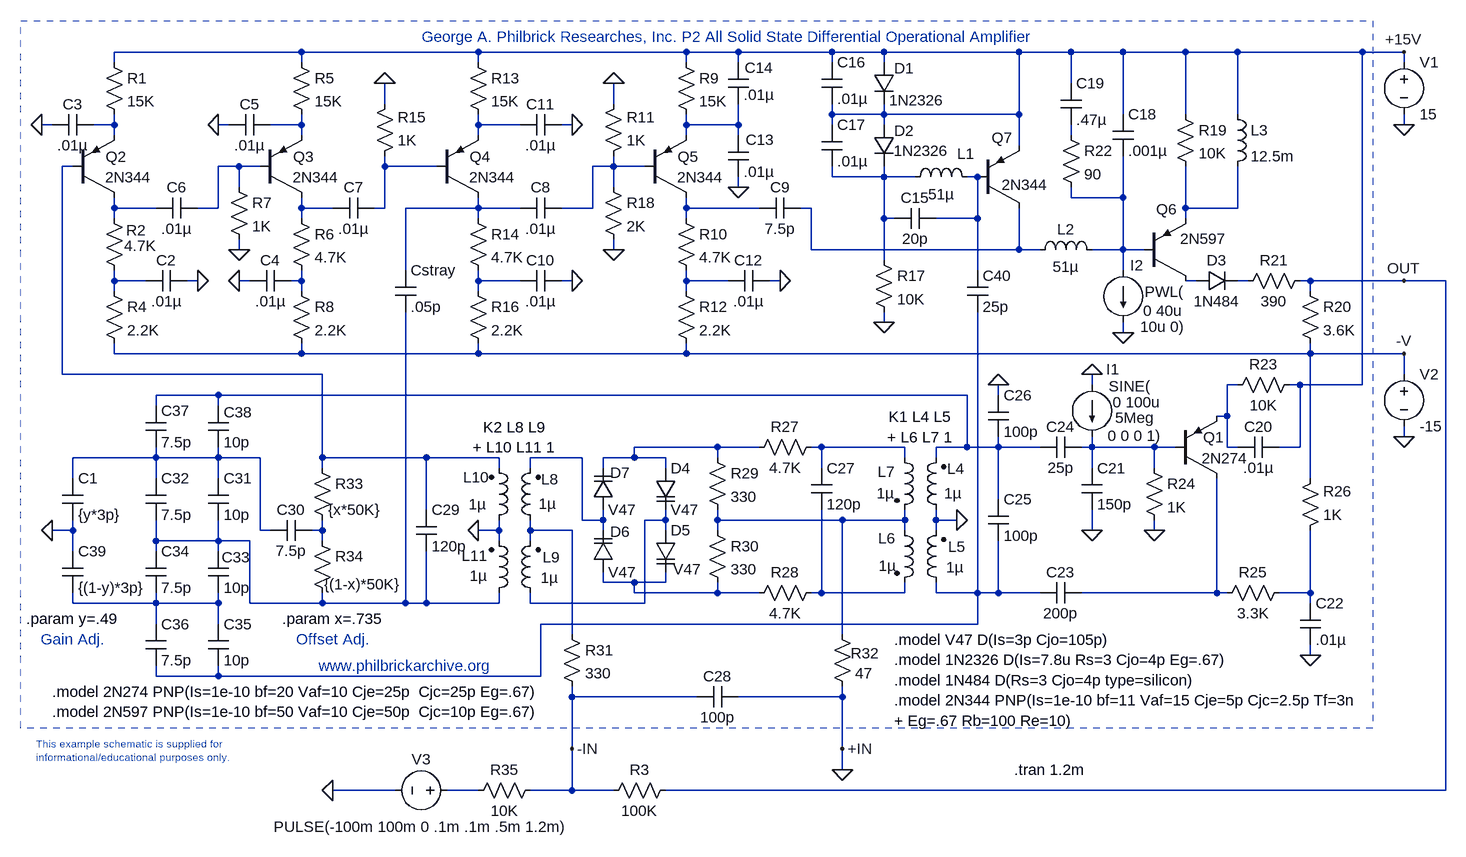
[diagram p0: schematic P2.asc]
P2.asc, the LTspice schematic file:
Version 4
SHEET 1 2948 1524
WIRE 464 16 176 16
WIRE 736 16 464 16
WIRE 1056 16 736 16
WIRE 1136 16 1056 16
WIRE 1280 16 1136 16
WIRE 1360 16 1280 16
WIRE 1568 16 1360 16
WIRE 1648 16 1568 16
WIRE 1728 16 1648 16
WIRE 1824 16 1728 16
WIRE 1904 16 1824 16
WIRE 2096 16 1904 16
WIRE 2160 16 2096 16
WIRE 176 32 176 16
WIRE 464 32 464 16
WIRE 736 32 736 16
WIRE 1056 32 1056 16
WIRE 1136 32 1136 16
WIRE 1280 32 1280 16
WIRE 1360 32 1360 16
WIRE 2160 32 2160 16
WIRE 1648 64 1648 16
WIRE 592 96 592 64
WIRE 944 96 944 64
WIRE 1280 112 1280 96
WIRE 1360 112 1360 96
WIRE 1360 112 1280 112
WIRE 1568 112 1568 16
WIRE 1568 112 1360 112
WIRE 1728 112 1728 16
WIRE 1824 112 1824 16
WIRE 1904 112 1904 16
WIRE 80 128 64 128
WIRE 176 128 176 112
WIRE 176 128 144 128
WIRE 352 128 336 128
WIRE 464 128 464 112
WIRE 464 128 416 128
WIRE 736 128 736 112
WIRE 800 128 736 128
WIRE 880 128 864 128
WIRE 1056 128 1056 112
WIRE 1136 128 1136 96
WIRE 1136 128 1056 128
WIRE 1280 128 1280 112
WIRE 1360 128 1360 112
WIRE 2160 128 2160 112
WIRE 176 144 176 128
WIRE 464 144 464 128
WIRE 736 144 736 128
WIRE 1056 144 1056 128
WIRE 1136 144 1136 128
WIRE 1648 144 1648 128
WIRE 1568 160 1568 112
WIRE 112 192 96 192
WIRE 368 192 336 192
WIRE 400 192 368 192
WIRE 592 192 592 176
WIRE 672 192 592 192
WIRE 944 192 944 176
WIRE 944 192 912 192
WIRE 992 192 944 192
WIRE 1280 208 1280 192
WIRE 1360 208 1360 192
WIRE 1360 208 1280 208
WIRE 1408 208 1360 208
WIRE 1504 208 1488 208
WIRE 368 224 368 192
WIRE 944 224 944 192
WIRE 1136 224 1136 208
WIRE 1648 240 1648 224
WIRE 1728 240 1728 176
WIRE 1728 240 1648 240
WIRE 176 256 176 240
WIRE 240 256 176 256
WIRE 336 256 336 192
WIRE 336 256 304 256
WIRE 464 256 464 240
WIRE 512 256 464 256
WIRE 592 256 592 192
WIRE 592 256 576 256
WIRE 736 256 736 240
WIRE 736 256 624 256
WIRE 800 256 736 256
WIRE 912 256 912 192
WIRE 912 256 864 256
WIRE 1056 256 1056 240
WIRE 1168 256 1056 256
WIRE 1248 256 1232 256
WIRE 1824 256 1824 192
WIRE 1904 256 1904 192
WIRE 1904 256 1824 256
WIRE 176 272 176 256
WIRE 464 272 464 256
WIRE 736 272 736 256
WIRE 1056 272 1056 256
WIRE 1360 272 1360 208
WIRE 1376 272 1360 272
WIRE 1504 272 1504 208
WIRE 1504 272 1440 272
WIRE 1824 272 1824 256
WIRE 368 320 368 304
WIRE 944 320 944 304
WIRE 1248 320 1248 256
WIRE 1568 320 1568 256
WIRE 1568 320 1248 320
WIRE 1600 320 1568 320
WIRE 1728 320 1728 240
WIRE 1728 320 1680 320
WIRE 1760 320 1728 320
WIRE 1360 336 1360 272
WIRE 624 352 624 256
WIRE 1504 352 1504 272
WIRE 1728 352 1728 320
WIRE 176 368 176 352
WIRE 224 368 176 368
WIRE 304 368 288 368
WIRE 384 368 368 368
WIRE 464 368 464 352
WIRE 464 368 448 368
WIRE 736 368 736 352
WIRE 800 368 736 368
WIRE 880 368 864 368
WIRE 1056 368 1056 352
WIRE 1120 368 1056 368
WIRE 1200 368 1184 368
WIRE 1840 368 1824 368
WIRE 1920 368 1904 368
WIRE 2016 368 2000 368
WIRE 2160 368 2016 368
WIRE 2224 368 2160 368
WIRE 176 384 176 368
WIRE 464 384 464 368
WIRE 736 384 736 368
WIRE 1056 384 1056 368
WIRE 2016 384 2016 368
WIRE 1360 432 1360 416
WIRE 1728 448 1728 432
WIRE 176 480 176 464
WIRE 464 480 464 464
WIRE 464 480 176 480
WIRE 736 480 736 464
WIRE 736 480 464 480
WIRE 1056 480 1056 464
WIRE 1056 480 736 480
WIRE 2016 480 2016 464
WIRE 2016 480 1056 480
WIRE 2160 480 2016 480
WIRE 96 512 96 192
WIRE 496 512 96 512
WIRE 2160 512 2160 480
WIRE 1680 528 1680 512
WIRE 1904 528 1888 528
WIRE 2000 528 1984 528
WIRE 2096 528 2096 16
WIRE 2096 528 2000 528
WIRE 336 544 240 544
WIRE 1488 544 336 544
WIRE 1536 544 1536 528
WIRE 240 560 240 544
WIRE 336 560 336 544
WIRE 1888 576 1888 528
WIRE 1888 576 1872 576
WIRE 2160 608 2160 592
WIRE 1104 624 976 624
WIRE 1168 624 1104 624
WIRE 1264 624 1248 624
WIRE 1392 624 1264 624
WIRE 1488 624 1488 544
WIRE 1488 624 1440 624
WIRE 1536 624 1536 608
WIRE 1536 624 1488 624
WIRE 1600 624 1536 624
WIRE 1680 624 1680 608
WIRE 1680 624 1664 624
WIRE 1776 624 1680 624
WIRE 1808 624 1776 624
WIRE 1888 624 1888 576
WIRE 1904 624 1888 624
WIRE 2000 624 2000 528
WIRE 2000 624 1968 624
WIRE 240 640 240 624
WIRE 240 640 112 640
WIRE 336 640 336 624
WIRE 336 640 240 640
WIRE 400 640 336 640
WIRE 496 640 496 512
WIRE 656 640 496 640
WIRE 768 640 656 640
WIRE 896 640 816 640
WIRE 976 640 976 624
WIRE 976 640 928 640
WIRE 1024 640 976 640
WIRE 1104 640 1104 624
WIRE 1392 640 1392 624
WIRE 1440 640 1440 624
WIRE 496 656 496 640
WIRE 768 656 768 640
WIRE 816 656 816 640
WIRE 928 656 928 640
WIRE 1024 656 1024 640
WIRE 1264 656 1264 624
WIRE 1680 656 1680 624
WIRE 1776 656 1776 624
WIRE 112 672 112 640
WIRE 240 672 240 640
WIRE 336 672 336 640
WIRE 2016 672 2016 480
WIRE 1536 704 1536 624
WIRE 656 720 656 640
WIRE 896 736 896 640
WIRE 928 736 928 720
WIRE 928 736 896 736
WIRE 1024 736 1024 720
WIRE 1024 736 992 736
WIRE 1104 736 1104 720
WIRE 1296 736 1104 736
WIRE 1392 736 1392 720
WIRE 1392 736 1296 736
WIRE 1440 736 1440 720
WIRE 1472 736 1440 736
WIRE 112 752 112 736
WIRE 112 752 80 752
WIRE 400 752 400 640
WIRE 416 752 400 752
WIRE 496 752 496 736
WIRE 496 752 480 752
WIRE 768 752 768 736
WIRE 768 752 736 752
WIRE 816 752 816 736
WIRE 880 752 816 752
WIRE 928 752 928 736
WIRE 1024 752 1024 736
WIRE 1104 752 1104 736
WIRE 1392 752 1392 736
WIRE 1440 752 1440 736
WIRE 1680 752 1680 720
WIRE 1776 752 1776 736
WIRE 240 768 240 736
WIRE 336 768 336 736
WIRE 336 768 240 768
WIRE 384 768 336 768
WIRE 496 768 496 752
WIRE 768 768 768 752
WIRE 816 768 816 752
WIRE 112 784 112 752
WIRE 240 784 240 768
WIRE 336 784 336 768
WIRE 928 832 928 816
WIRE 976 832 928 832
WIRE 1024 832 1024 816
WIRE 1024 832 976 832
WIRE 976 848 976 832
WIRE 1104 848 1104 832
WIRE 1104 848 976 848
WIRE 1168 848 1104 848
WIRE 1264 848 1264 720
WIRE 1264 848 1248 848
WIRE 1392 848 1392 832
WIRE 1392 848 1264 848
WIRE 1440 848 1440 832
WIRE 1504 848 1504 416
WIRE 1504 848 1440 848
WIRE 1536 848 1536 768
WIRE 1536 848 1504 848
WIRE 1600 848 1536 848
WIRE 1872 848 1872 672
WIRE 1872 848 1664 848
WIRE 1888 848 1872 848
WIRE 2016 848 2016 752
WIRE 2016 848 1968 848
WIRE 112 864 112 848
WIRE 240 864 240 848
WIRE 240 864 112 864
WIRE 336 864 336 848
WIRE 336 864 240 864
WIRE 384 864 384 768
WIRE 496 864 496 848
WIRE 496 864 384 864
WIRE 624 864 624 416
WIRE 624 864 496 864
WIRE 656 864 656 784
WIRE 656 864 624 864
WIRE 768 864 768 848
WIRE 768 864 656 864
WIRE 816 864 816 848
WIRE 992 864 992 736
WIRE 992 864 816 864
WIRE 2016 864 2016 848
WIRE 240 896 240 864
WIRE 336 896 336 864
WIRE 1504 896 1504 848
WIRE 1504 896 832 896
WIRE 880 912 880 752
WIRE 1296 912 1296 736
WIRE 2016 944 2016 928
WIRE 240 976 240 960
WIRE 336 976 336 960
WIRE 336 976 240 976
WIRE 832 976 832 896
WIRE 832 976 336 976
WIRE 880 1008 880 992
WIRE 1072 1008 880 1008
WIRE 1296 1008 1296 992
WIRE 1296 1008 1136 1008
WIRE 880 1088 880 1008
WIRE 1296 1088 1296 1008
WIRE 1296 1120 1296 1088
WIRE 608 1152 512 1152
WIRE 736 1152 688 1152
WIRE 880 1152 880 1088
WIRE 880 1152 816 1152
WIRE 944 1152 880 1152
WIRE 2224 1152 2224 368
WIRE 2224 1152 1024 1152
FLAG 2160 16 +15V
FLAG 2160 128 0
FLAG 2160 608 0
FLAG 304 368 0
FLAG 64 128 0
FLAG 368 320 0
FLAG 368 368 0
FLAG 336 128 0
FLAG 592 64 0
FLAG 880 368 0
FLAG 880 128 0
FLAG 944 64 0
FLAG 1200 368 0
FLAG 1136 224 0
FLAG 944 320 0
FLAG 1360 432 0
FLAG 1776 752 0
FLAG 2016 944 0
FLAG 1680 752 0
FLAG 1536 528 0
FLAG 1472 736 0
FLAG 1296 1120 0
FLAG 736 752 0
FLAG 80 752 0
FLAG 1680 512 0
FLAG 1728 448 0
FLAG 2160 480 -V
FLAG 2160 368 OUT
FLAG 880 1088 -IN
FLAG 1296 1088 +IN
FLAG 512 1152 0
SYMBOL pnp 112 240 M180
WINDOW 0 51 63 Left 2
WINDOW 3 50 31 Left 2
SYMATTR InstName Q2
SYMATTR Value 2N344
SYMBOL res 160 16 R0
SYMATTR InstName R1
SYMATTR Value 15K
SYMBOL res 160 256 R0
WINDOW 0 34 34 Left 2
WINDOW 3 31 58 Left 2
SYMATTR InstName R2
SYMATTR Value 4.7K
SYMBOL res 160 368 R0
SYMATTR InstName R4
SYMATTR Value 2.2K
SYMBOL voltage 2160 16 R0
SYMATTR InstName V1
SYMATTR Value 15
SYMBOL voltage 2160 496 R0
SYMATTR InstName V2
SYMATTR Value -15
SYMBOL cap 288 384 M270
WINDOW 0 32 32 VTop 2
WINDOW 3 0 32 VBottom 2
SYMATTR InstName C2
SYMATTR Value .01µ
SYMBOL cap 80 144 R270
WINDOW 0 32 32 VTop 2
WINDOW 3 0 32 VBottom 2
SYMATTR InstName C3
SYMATTR Value .01µ
SYMBOL res 448 16 R0
SYMATTR InstName R5
SYMATTR Value 15K
SYMBOL res 448 256 R0
SYMATTR InstName R6
SYMATTR Value 4.7K
SYMBOL res 352 208 R0
SYMATTR InstName R7
SYMATTR Value 1K
SYMBOL res 448 368 R0
SYMATTR InstName R8
SYMATTR Value 2.2K
SYMBOL cap 384 384 R270
WINDOW 0 32 32 VTop 2
WINDOW 3 0 32 VBottom 2
SYMATTR InstName C4
SYMATTR Value .01µ
SYMBOL cap 352 144 R270
WINDOW 0 32 32 VTop 2
WINDOW 3 0 32 VBottom 2
SYMATTR InstName C5
SYMATTR Value .01µ
SYMBOL res 720 16 R0
SYMATTR InstName R13
SYMATTR Value 15K
SYMBOL res 720 256 R0
SYMATTR InstName R14
SYMATTR Value 4.7K
SYMBOL res 576 192 M180
WINDOW 0 36 76 Left 2
WINDOW 3 36 40 Left 2
SYMATTR InstName R15
SYMATTR Value 1K
SYMBOL res 720 368 R0
SYMATTR InstName R16
SYMATTR Value 2.2K
SYMBOL cap 864 384 M270
WINDOW 0 32 32 VTop 2
WINDOW 3 0 32 VBottom 2
SYMATTR InstName C10
SYMATTR Value .01µ
SYMBOL cap 864 112 R90
WINDOW 0 0 32 VBottom 2
WINDOW 3 32 32 VTop 2
SYMATTR InstName C11
SYMATTR Value .01µ
SYMBOL res 1040 16 R0
SYMATTR InstName R9
SYMATTR Value 15K
SYMBOL res 1040 256 R0
SYMATTR InstName R10
SYMATTR Value 4.7K
SYMBOL res 928 192 M180
WINDOW 0 36 76 Left 2
WINDOW 3 36 40 Left 2
SYMATTR InstName R11
SYMATTR Value 1K
SYMBOL res 1040 368 R0
SYMATTR InstName R12
SYMATTR Value 2.2K
SYMBOL cap 1184 384 M270
WINDOW 0 32 32 VTop 2
WINDOW 3 0 32 VBottom 2
SYMATTR InstName C12
SYMATTR Value .01µ
SYMBOL cap 1120 208 M180
WINDOW 0 27 57 Left 2
WINDOW 3 24 8 Left 2
SYMATTR InstName C13
SYMATTR Value .01µ
SYMBOL cap 304 272 M270
WINDOW 0 32 32 VTop 2
WINDOW 3 0 32 VBottom 2
SYMATTR InstName C6
SYMATTR Value .01µ
SYMBOL cap 576 272 M270
WINDOW 0 32 32 VTop 2
WINDOW 3 0 32 VBottom 2
SYMATTR InstName C7
SYMATTR Value .01µ
SYMBOL cap 864 272 M270
WINDOW 0 32 32 VTop 2
WINDOW 3 0 32 VBottom 2
SYMATTR InstName C8
SYMATTR Value .01µ
SYMBOL cap 1232 272 M270
WINDOW 0 32 32 VTop 2
WINDOW 3 0 32 VBottom 2
SYMATTR InstName C9
SYMATTR Value 7.5p
SYMBOL pnp 400 240 M180
WINDOW 0 51 63 Left 2
WINDOW 3 50 31 Left 2
SYMATTR InstName Q3
SYMATTR Value 2N344
SYMBOL pnp 672 240 M180
WINDOW 0 51 63 Left 2
WINDOW 3 50 31 Left 2
SYMATTR InstName Q4
SYMATTR Value 2N344
SYMBOL pnp 992 240 M180
WINDOW 0 51 63 Left 2
WINDOW 3 50 31 Left 2
SYMATTR InstName Q5
SYMATTR Value 2N344
SYMBOL res 928 208 R0
SYMATTR InstName R18
SYMATTR Value 2K
SYMBOL cap 1120 96 M180
WINDOW 0 26 56 Left 2
WINDOW 3 24 14 Left 2
SYMATTR InstName C14
SYMATTR Value .01µ
SYMBOL pnp 1504 256 M180
WINDOW 0 54 108 Right 2
WINDOW 3 37 36 Left 2
SYMATTR InstName Q7
SYMATTR Value 2N344
SYMBOL diode 1344 32 R0
WINDOW 0 32 9 Left 2
WINDOW 3 24 58 Left 2
SYMATTR InstName D1
SYMATTR Value 1N2326
SYMBOL cap 1264 96 M180
WINDOW 0 24 64 Left 2
WINDOW 3 24 8 Left 2
SYMATTR InstName C16
SYMATTR Value .01µ
SYMBOL cap 1264 192 M180
WINDOW 0 24 64 Left 2
WINDOW 3 24 8 Left 2
SYMATTR InstName C17
SYMATTR Value .01µ
SYMBOL ind 1392 224 R270
WINDOW 0 36 94 VTop 2
WINDOW 3 5 56 VBottom 2
SYMATTR InstName L1
SYMATTR Value 51µ
SYMATTR SpiceLine Rser=1
SYMBOL ind 1584 336 R270
WINDOW 0 32 56 VTop 2
WINDOW 3 5 56 VBottom 2
SYMATTR InstName L2
SYMATTR Value 51µ
SYMATTR SpiceLine Rser=1
SYMBOL cap 1440 256 R90
WINDOW 0 0 32 VBottom 2
WINDOW 3 32 32 VTop 2
SYMATTR InstName C15
SYMATTR Value 20p
SYMBOL res 1344 320 R0
SYMATTR InstName R17
SYMATTR Value 10K
SYMBOL diode 1344 128 R0
WINDOW 0 32 9 Left 2
WINDOW 3 31 40 Left 2
SYMATTR InstName D2
SYMATTR Value 1N2326
SYMBOL pnp 1760 368 M180
WINDOW 0 51 110 Right 2
WINDOW 3 56 65 Left 2
SYMATTR InstName Q6
SYMATTR Value 2N597
SYMBOL res 1808 96 R0
SYMATTR InstName R19
SYMATTR Value 10K
SYMBOL ind 1888 96 R0
SYMATTR InstName L3
SYMATTR Value 12.5m
SYMBOL diode 1840 384 R270
WINDOW 3 0 32 VBottom 2
WINDOW 0 32 32 VTop 2
SYMATTR Value 1N484
SYMATTR InstName D3
SYMBOL res 2000 368 R0
SYMATTR InstName R20
SYMATTR Value 3.6K
SYMBOL res 1904 384 R270
WINDOW 0 32 56 VTop 2
WINDOW 3 0 56 VBottom 2
SYMATTR InstName R21
SYMATTR Value 390
SYMBOL cap 1712 176 M180
WINDOW 0 24 64 Left 2
WINDOW 3 24 8 Left 2
SYMATTR InstName C18
SYMATTR Value .001µ
SYMBOL cap 1632 128 M180
WINDOW 0 24 64 Left 2
WINDOW 3 24 8 Left 2
SYMATTR InstName C19
SYMATTR Value .47µ
SYMBOL res 1632 128 R0
SYMATTR InstName R22
SYMATTR Value 90
SYMBOL pnp 1808 672 M180
WINDOW 0 43 63 Left 2
WINDOW 3 41 31 Left 2
SYMATTR InstName Q1
SYMATTR Value 2N274
SYMBOL res 2000 512 R90
WINDOW 0 0 56 VBottom 2
WINDOW 3 32 56 VTop 2
SYMATTR InstName R23
SYMATTR Value 10K
SYMBOL cap 1904 608 M90
WINDOW 0 0 32 VBottom 2
WINDOW 3 32 32 VTop 2
SYMATTR InstName C20
SYMATTR Value .01µ
SYMBOL res 1760 640 R0
SYMATTR InstName R24
SYMATTR Value 1K
SYMBOL cap 1664 720 M180
WINDOW 0 24 64 Left 2
WINDOW 3 24 8 Left 2
SYMATTR InstName C21
SYMATTR Value 150p
SYMBOL res 1872 864 R270
WINDOW 0 32 56 VTop 2
WINDOW 3 0 56 VBottom 2
SYMATTR InstName R25
SYMATTR Value 3.3K
SYMBOL res 2000 768 M180
WINDOW 0 36 76 Left 2
WINDOW 3 36 40 Left 2
SYMATTR InstName R26
SYMATTR Value 1K
SYMBOL cap 2000 928 M180
WINDOW 0 24 64 Left 2
WINDOW 3 24 8 Left 2
SYMATTR InstName C22
SYMATTR Value .01µ
SYMBOL cap 1664 864 M270
WINDOW 0 32 32 VTop 2
WINDOW 3 0 32 VBottom 2
SYMATTR InstName C23
SYMATTR Value 200p
SYMBOL cap 1664 640 M270
WINDOW 0 32 32 VTop 2
WINDOW 3 0 32 VBottom 2
SYMATTR InstName C24
SYMATTR Value 25p
SYMBOL cap 1520 768 M180
WINDOW 0 24 64 Left 2
WINDOW 3 24 8 Left 2
SYMATTR InstName C25
SYMATTR Value 100p
SYMBOL cap 1520 608 M180
WINDOW 0 24 64 Left 2
WINDOW 3 24 8 Left 2
SYMATTR InstName C26
SYMATTR Value 100p
SYMBOL ind2 1456 736 R180
WINDOW 0 -1 79 Right 2
WINDOW 3 3 41 Right 2
SYMATTR InstName L4
SYMATTR Value 1µ
SYMATTR Type ind
SYMBOL ind2 1456 848 R180
WINDOW 0 -3 71 Right 2
WINDOW 3 0 39 Right 2
SYMATTR InstName L5
SYMATTR Value 1µ
SYMATTR Type ind
SYMBOL ind2 1376 736 R0
WINDOW 0 2 28 Right 2
WINDOW 3 3 70 Right 2
SYMATTR InstName L6
SYMATTR Value 1µ
SYMATTR Type ind
SYMBOL ind2 1376 624 R0
WINDOW 0 1 38 Right 2
WINDOW 3 0 71 Right 2
SYMATTR InstName L7
SYMATTR Value 1µ
SYMATTR Type ind
SYMBOL cap 1248 720 M180
WINDOW 0 24 64 Left 2
WINDOW 3 24 8 Left 2
SYMATTR InstName C27
SYMATTR Value 120p
SYMBOL res 1264 608 R90
WINDOW 0 0 56 VBottom 2
WINDOW 3 32 56 VTop 2
SYMATTR InstName R27
SYMATTR Value 4.7K
SYMBOL res 1264 832 R90
WINDOW 0 0 56 VBottom 2
WINDOW 3 32 56 VTop 2
SYMATTR InstName R28
SYMATTR Value 4.7K
SYMBOL res 1088 624 R0
SYMATTR InstName R29
SYMATTR Value 330
SYMBOL res 1088 736 R0
SYMATTR InstName R30
SYMATTR Value 330
SYMBOL varactor 1008 656 R0
SYMATTR Value V47
SYMATTR InstName D4
SYMBOL varactor 1008 752 R0
WINDOW 3 28 60 Left 2
SYMATTR Value V47
SYMATTR InstName D5
SYMBOL varactor 912 816 M180
WINDOW 0 27 62 Left 2
WINDOW 3 24 0 Left 2
SYMATTR InstName D6
SYMATTR Value V47
SYMBOL varactor 912 720 M180
WINDOW 0 27 57 Left 2
WINDOW 3 24 0 Left 2
SYMATTR InstName D7
SYMATTR Value V47
SYMBOL ind2 832 752 R180
WINDOW 0 -1 79 Right 2
WINDOW 3 3 41 Right 2
SYMATTR InstName L8
SYMATTR Value 1µ
SYMATTR Type ind
SYMBOL ind2 832 864 R180
WINDOW 0 -3 71 Right 2
WINDOW 3 0 39 Right 2
SYMATTR InstName L9
SYMATTR Value 1µ
SYMATTR Type ind
SYMBOL ind2 752 752 M180
WINDOW 0 1 82 Right 2
WINDOW 3 -4 40 Right 2
SYMATTR InstName L10
SYMATTR Value 1µ
SYMATTR Type ind
SYMBOL ind2 752 864 M180
WINDOW 0 -1 73 Right 2
WINDOW 3 -2 42 Right 2
SYMATTR InstName L11
SYMATTR Value 1µ
SYMATTR Type ind
SYMBOL res 864 896 R0
SYMATTR InstName R31
SYMATTR Value 330
SYMBOL res 1280 896 R0
WINDOW 0 29 45 Left 2
SYMATTR InstName R32
SYMATTR Value 47
SYMBOL cap 1136 1024 M270
WINDOW 0 32 32 VTop 2
WINDOW 3 0 32 VBottom 2
SYMATTR InstName C28
SYMATTR Value 100p
SYMBOL cap 640 784 M180
WINDOW 0 24 64 Left 2
WINDOW 3 24 8 Left 2
SYMATTR InstName C29
SYMATTR Value 120p
SYMBOL res 480 640 R0
WINDOW 3 25 80 Left 2
SYMATTR Value {x*50K}
SYMATTR InstName R33
SYMBOL res 480 752 R0
WINDOW 3 19 83 Left 2
SYMATTR Value {(1-x)*50K}
SYMATTR InstName R34
SYMBOL cap 480 768 M270
WINDOW 0 32 32 VTop 2
WINDOW 3 0 32 VBottom 2
SYMATTR InstName C30
SYMATTR Value 7.5p
SYMBOL cap 320 736 M180
WINDOW 0 24 64 Left 2
WINDOW 3 24 8 Left 2
SYMATTR InstName C31
SYMATTR Value 10p
SYMBOL cap 224 736 M180
WINDOW 0 24 64 Left 2
WINDOW 3 24 8 Left 2
SYMATTR InstName C32
SYMATTR Value 7.5p
SYMBOL cap 320 848 M180
WINDOW 0 21 55 Left 2
WINDOW 3 24 8 Left 2
SYMATTR InstName C33
SYMATTR Value 10p
SYMBOL cap 224 848 M180
WINDOW 0 24 64 Left 2
WINDOW 3 24 8 Left 2
SYMATTR InstName C34
SYMATTR Value 7.5p
SYMBOL cap 320 960 M180
WINDOW 0 24 64 Left 2
WINDOW 3 24 8 Left 2
SYMATTR InstName C35
SYMATTR Value 10p
SYMBOL cap 224 960 M180
WINDOW 0 24 64 Left 2
WINDOW 3 24 8 Left 2
SYMATTR InstName C36
SYMATTR Value 7.5p
SYMBOL cap 224 624 M180
WINDOW 0 24 56 Left 2
WINDOW 3 24 8 Left 2
SYMATTR InstName C37
SYMATTR Value 7.5p
SYMBOL cap 320 624 M180
WINDOW 0 24 54 Left 2
WINDOW 3 24 8 Left 2
SYMATTR InstName C38
SYMATTR Value 10p
SYMBOL cap 96 736 M180
WINDOW 0 24 64 Left 2
WINDOW 3 24 8 Left 2
SYMATTR InstName C1
SYMATTR Value {y*3p}
SYMBOL cap 96 848 M180
WINDOW 0 24 64 Left 2
WINDOW 3 24 8 Left 2
SYMATTR InstName C39
SYMATTR Value {(1-y)*3p}
SYMBOL cap 1488 352 R0
SYMATTR InstName C40
SYMATTR Value 25p
SYMBOL current 1680 528 R0
WINDOW 0 22 -24 Left 2
WINDOW 3 26 2 Left 2
WINDOW 123 32 27 Left 2
WINDOW 39 36 51 Left 2
WINDOW 40 24 78 Left 2
SYMATTR InstName I1
SYMATTR Value SINE(
SYMATTR Value2 0 100u
SYMATTR SpiceLine 5Meg
SYMATTR SpiceLine2 0 0 0 1)
SYMBOL current 1728 352 R0
WINDOW 3 33 33 Left 2
WINDOW 123 31 62 Left 2
WINDOW 39 26 87 Left 2
WINDOW 0 11 -8 Left 2
SYMATTR Value PWL(
SYMATTR Value2 0 40u
SYMATTR SpiceLine 10u 0)
SYMATTR InstName I2
SYMBOL voltage 704 1152 R90
WINDOW 0 -32 56 VBottom 2
WINDOW 3 40 56 VTop 2
SYMATTR InstName V3
SYMATTR Value PULSE(-100m 100m 0 .1m .1m .5m 1.2m)
SYMBOL res 1040 1136 R90
WINDOW 0 0 56 VBottom 2
WINDOW 3 32 56 VTop 2
SYMATTR InstName R3
SYMATTR Value 100K
SYMBOL res 832 1136 R90
WINDOW 0 0 56 VBottom 2
WINDOW 3 32 56 VTop 2
SYMATTR InstName R35
SYMATTR Value 10K
SYMBOL cap 608 416 M180
WINDOW 0 24 64 Left 2
WINDOW 3 24 8 Left 2
SYMATTR InstName Cstray
SYMATTR Value .05p
TEXT 1376 920 Left 2 !.model V47 D(Is=3p Cjo=105p)\n.model 1N2326 D(Is=7.8u Rs=3 Cjo=4p Eg=.67)\n.model 1N484 D(Rs=3 Cjo=4p type=silicon)\n.model 2N344 PNP(Is=1e-10 bf=11 Vaf=15 Cje=5p Cjc=2.5p Tf=3n\n+ Eg=.67 Rb=100 Re=10)
TEXT 1560 1120 Left 2 !.tran 1.2m
TEXT 1416 624 Bottom 2 !K1 L4 L5\n+ L6 L7 1
TEXT 792 640 Bottom 2 !K2 L8 L9\n+ L10 L11 1
TEXT 512 872 Top 2 !.param x=.735
TEXT 112 872 Top 2 !.param y=.49
TEXT 1120 8 Bottom 2 ;George A. Philbrick Researches, Inc. P2 All Solid State Differential Operational Amplifier
TEXT 56 1080 Left 1 ;This example schematic is supplied for\ninformational/educational purposes only.
TEXT 624 960 Center 2 ;www.philbrickarchive.org
TEXT 112 904 Top 2 ;Gain Adj.
TEXT 512 904 Top 2 ;Offset Adj.
TEXT 80 1000 Left 2 !.model 2N274 PNP(Is=1e-10 bf=20 Vaf=10 Cje=25p  Cjc=25p Eg=.67)\n.model 2N597 PNP(Is=1e-10 bf=50 Vaf=10 Cje=50p  Cjc=10p Eg=.67)
RECTANGLE Normal 2112 1056 32 -32 2

The netlist it stands for:
* P2.asc
Q2 N013 N006 N001 0 2N344
R1 +15V N001 15K
R2 N013 N019 4.7K
R4 N019 -V 2.2K
V1 +15V 0 15
V2 -V 0 -15
C2 0 N019 .01µ
C3 0 N001 .01µ
R5 +15V N002 15K
R6 N014 N020 4.7K
R7 N007 0 1K
R8 N020 -V 2.2K
C4 0 N020 .01µ
C5 0 N002 .01µ
R13 +15V N003 15K
R14 N015 N021 4.7K
R15 N008 0 1K
R16 N021 -V 2.2K
C10 0 N021 .01µ
C11 0 N003 .01µ
R9 +15V N004 15K
R10 N016 N022 4.7K
R11 N009 0 1K
R12 N022 -V 2.2K
C12 0 N022 .01µ
C13 0 N004 .01µ
C6 N007 N013 .01µ
C7 N008 N014 .01µ
C8 N009 N015 .01µ
C9 N017 N016 7.5p
Q3 N014 N007 N002 0 2N344
Q4 N015 N008 N003 0 2N344
Q5 N016 N009 N004 0 2N344
R18 N009 0 2K
C14 N004 +15V .01µ
Q7 N017 N011 +15V 0 2N344
D1 +15V +15V 1N2326
C16 +15V +15V .01µ
C17 N010 +15V .01µ
L1 N010 N011 51µ Rser=1
L2 N017 N012 51µ Rser=1
C15 N011 N010 20p
R17 N010 0 10K
D2 +15V N010 1N2326
Q6 N023 N012 N018 0 2N597
R19 +15V N018 10K
L3 +15V N018 12.5m
D3 N023 N024 1N484
R20 OUT -V 3.6K
R21 N024 OUT 390
C18 N012 +15V .001µ
C19 N005 +15V .47µ
R22 N005 N012 90
Q1 N040 N029 N025 0 2N274
R23 +15V N025 10K
C20 N025 +15V .01µ
R24 N029 0 1K
C21 0 N029 150p
R25 N040 N041 3.3K
R26 N041 -V 1K
C22 0 N041 .01µ
C23 N040 N039 200p
C24 N029 N026 25p
C25 N039 N026 100p
C26 N026 0 100p
L4 0 N026 1µ
L5 N039 0 1µ
L6 N033 N038 1µ
L7 N028 N033 1µ
C27 N038 N028 120p
R27 N028 N027 4.7K
R28 N038 N037 4.7K
R29 N027 N033 330
R30 N033 N037 330
D4 N027 N032 V47
D5 N032 N037 V47
D6 N037 N031 V47
D7 N031 N027 V47
L8 N035 N031 1µ
L9 N032 N035 1µ
L10 0 N006 1µ
L11 N036 0 1µ
R31 N035 -IN 330
R32 N033 0 47
C28 0 -IN 100p
C29 N036 N006 120p
R33 N006 N034 {x*50K}
R34 N034 N036 {(1-x)*50K}
C30 N034 N030 7.5p
C31 N036 N030 10p
C32 N036 N030 7.5p
C33 N042 N036 10p
C34 N042 N036 7.5p
C35 N039 N042 10p
C36 N039 N042 7.5p
C37 N030 N026 7.5p
C38 N030 N026 10p
C1 0 N030 {y*3p}
C39 N042 0 {(1-y)*3p}
C40 N011 N039 25p
I1 0 N029 SINE( 0 100u 5Meg 0 0 0 1)
I2 N012 0 PWL( 0 40u 10u 0)
V3 N043 0 PULSE(-100m 100m 0 .1m .1m .5m 1.2m)
R3 OUT -IN 100K
R35 -IN N043 10K
Cstray N036 N015 .05p
.model D D
.lib standard.dio
.model NPN NPN
.model PNP PNP
.lib standard.bjt
.model V47 D(Is=3p Cjo=105p)
.model 1N2326 D(Is=7.8u Rs=3 Cjo=4p Eg=.67)
.model 1N484 D(Rs=3 Cjo=4p type=silicon)
.model 2N344 PNP(Is=1e-10 bf=11 Vaf=15 Cje=5p Cjc=2.5p Tf=3n
+ Eg=.67 Rb=100 Re=10)
.tran 1.2m
K1 L4 L5
+ L6 L7 1
K2 L8 L9
+ L10 L11 1
.param x=.735
.param y=.49
* George A. Philbrick Researches, Inc. P2 All Solid State Differential Operational Amplifier
* This example schematic is supplied for
* informational/educational purposes only.
* www.philbrickarchive.org
* Gain Adj.
* Offset Adj.
.model 2N274 PNP(Is=1e-10 bf=20 Vaf=10 Cje=25p  Cjc=25p Eg=.67)
.model 2N597 PNP(Is=1e-10 bf=50 Vaf=10 Cje=50p  Cjc=10p Eg=.67)
.backanno
.end